# EAGLE design J2C_Video (EAGLE 7.2.0)
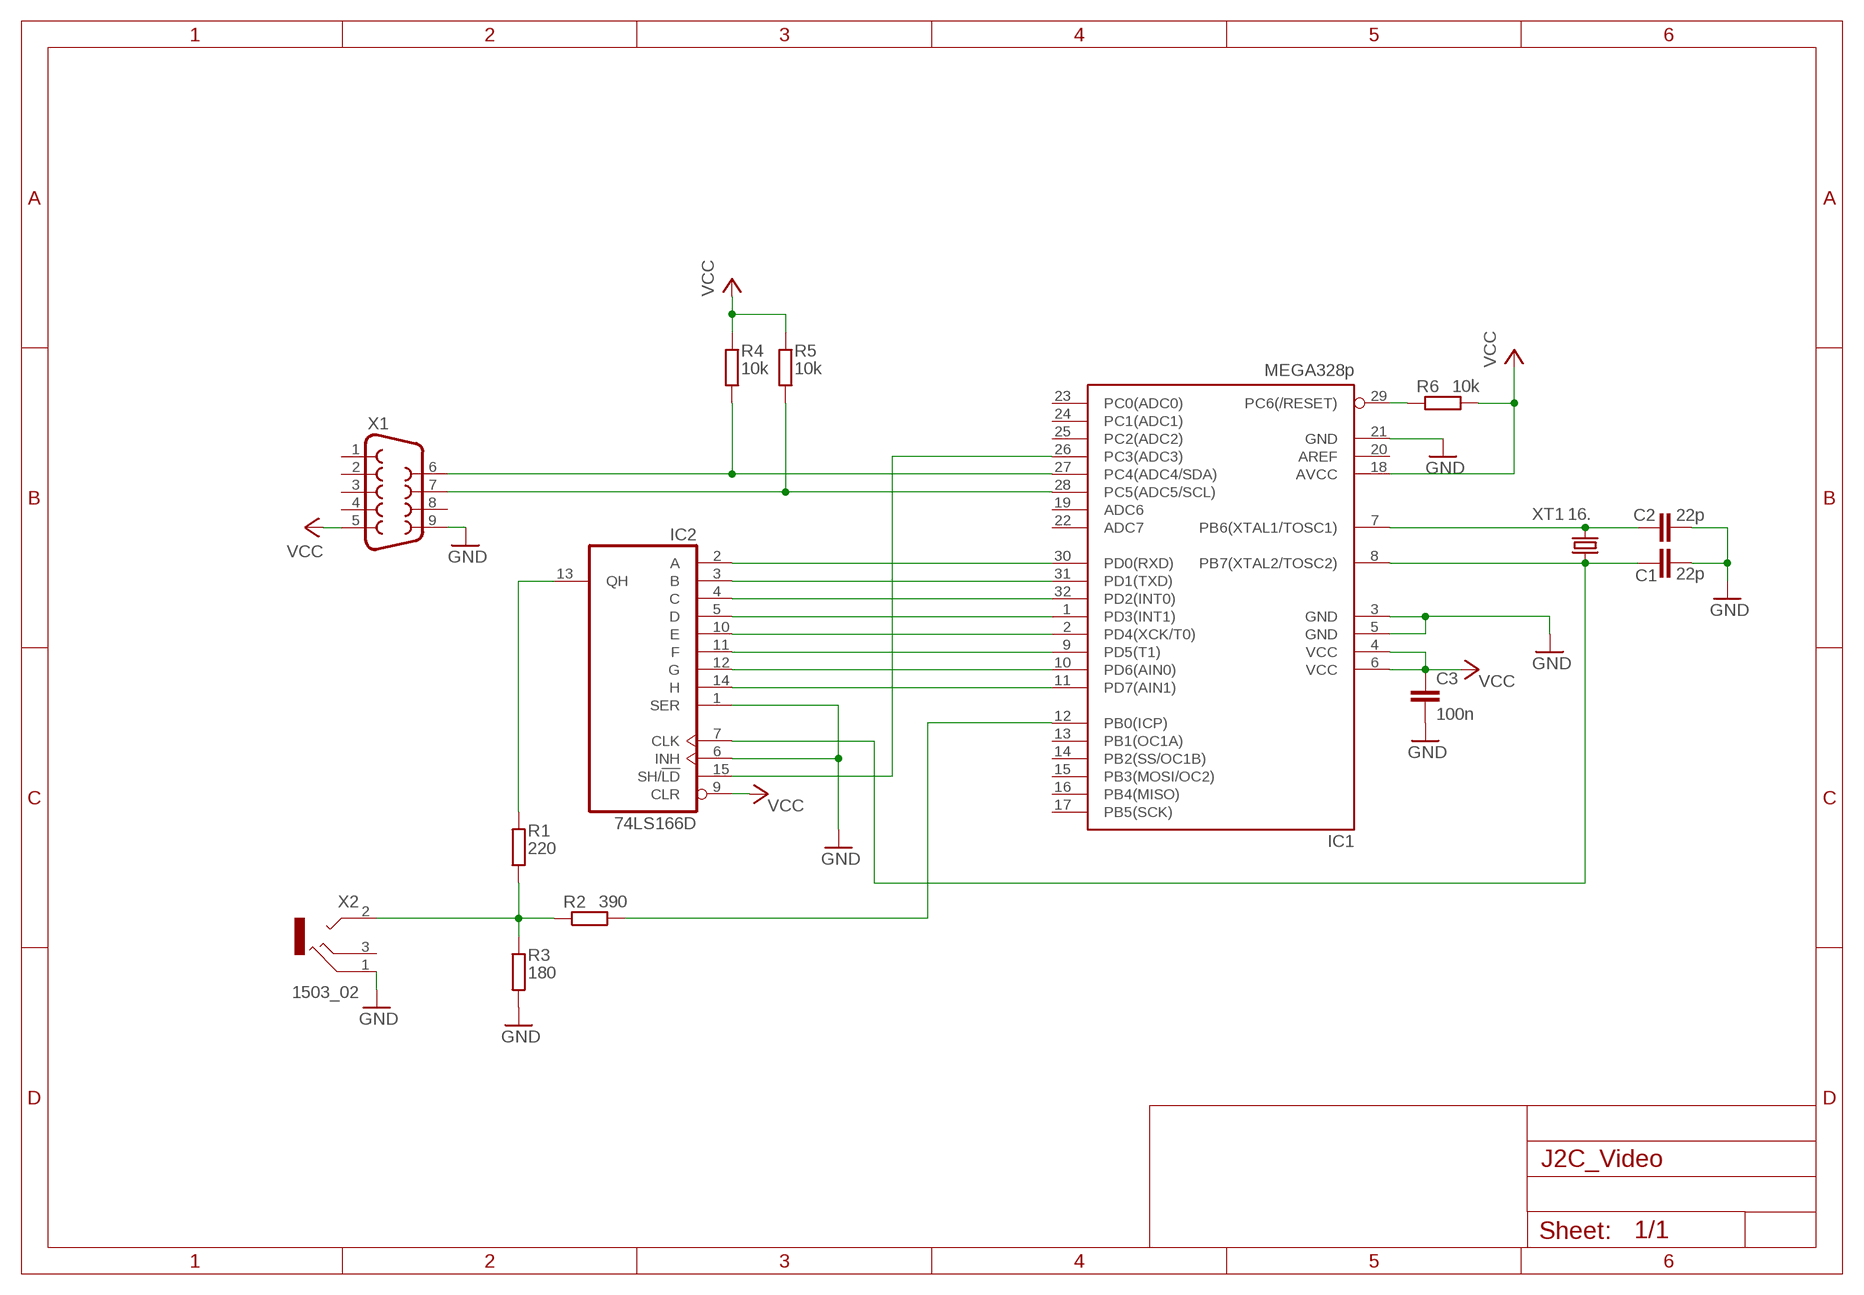
[diagram p0: schematic, sheet 1]

## Parts
C1  22p  C-EUC0805  [C0805]
C2  22p  C-EUC0805  [C0805]
C3  100n  C-EUC0805  [C0805]
IC1  MEGA328p  MEGA8-AI  [TQFP32-08]
IC2  74LS166D  [SO16]
R1  220  R-EU_M0805  [M0805]
R2  390  R-EU_M0805  [M0805]
R3  180  R-EU_M0805  [M0805]
R4  10k  R-EU_M0805  [M0805]
R5  10k  R-EU_M0805  [M0805]
R6  10k  R-EU_M0805  [M0805]
X1  F09D  [F09D]
X2  1503_02  [1503_02]
XT1  16.  CRYSTALTC26V  [TC26V]

## Nets
GND: C1.2 C2.2 C3.2 IC1.3(GND) IC1.5(GND) IC1.21(GND) IC2.1(SER) IC2.6(INH) R3.2 X1.9 X2.1
N$1: IC1.30(PD0(RXD)) IC2.2(A)
N$2: IC1.31(PD1(TXD)) IC2.3(B)
N$3: IC1.32(PD2(INT0)) IC2.4(C)
N$4: IC1.1(PD3(INT1)) IC2.5(D)
N$5: IC1.27(PC4(ADC4/SDA)) R4.2 X1.6
N$6: IC1.28(PC5(ADC5/SCL)) R5.2 X1.7
N$8: IC1.2(PD4(XCK/T0)) IC2.10(E)
N$9: IC1.9(PD5(T1)) IC2.11(F)
N$10: IC1.10(PD6(AIN0)) IC2.12(G)
N$11: IC1.11(PD7(AIN1)) IC2.14(H)
N$12: IC1.26(PC3(ADC3)) IC2.15(SH/!LD)
N$13: IC2.13(QH) R1.2
N$14: IC1.12(PB0(ICP)) R2.2
N$15: R1.1 R2.1 R3.1 X2.2
N$16: IC1.29(PC6(/RESET)) R6.1
VCC: C3.1 IC1.4(VCC) IC1.6(VCC) IC1.18(AVCC) IC2.9(CLR) R4.1 R5.1 R6.2 X1.5
X1: C2.1 IC1.7(PB6(XTAL1/TOSC1)) XT1.2
X2: C1.1 IC1.8(PB7(XTAL2/TOSC2)) IC2.7(CLK) XT1.1
Unconnected: IC1.13(PB1(OC1A)) IC1.14(PB2(SS/OC1B)) IC1.15(PB3(MOSI/OC2)) IC1.16(PB4(MISO)) IC1.17(PB5(SCK)) IC1.19(ADC6) IC1.20(AREF) IC1.22(ADC7) IC1.23(PC0(ADC0)) IC1.24(PC1(ADC1)) IC1.25(PC2(ADC2)) X1.1 X1.2 X1.3 X1.4 X1.8 X2.2@2 X2.3

## Power pins joined to a net without a drawn wire
GND: IC2.8(GND)
VCC: IC2.16(VCC)

## Library data of the parts
C1-C3 = rcl:C-EU: CAPACITOR, European symbol
IC1 = atmel:MEGA8: MICROCONTROLLER 8 Kbytes FLASH, 1 kbytes SRAM, 512 bytes EEPROM, USART, 6-channel 10 bit ADC, 2-channel 8 bit ADC Pin compatible with Atmega48, ATMega88, ATMega168 Source: avr.lbr; MPN: ATMEGA8-16AU; OC_FARNELL: 9171371; OC_NEWARK: 73M8863
IC2 = 74xx-us:74*166: 8-bit parallel load SHIFT REGISTER
R1-R6 = rcl:R-EU_: RESISTOR, European symbol
X1 = con-subd:F09: SUB-D; OC_FARNELL: unknown; OC_NEWARK: unknown
X2 = con-lumberg:1503_02: Jack connectors according to JISC 6560, 3.5 mm Klinkeneinbaukupplung nach JISC 6560, 3,5 mm, 3-polig/stereo, abgewinkelte Ausführung, Surface-Mount-Technik (SMT) Source: http://www.lumberg.com/Produkte/PDFs/1503_02.pdf; OC_FARNELL: 1216979; OC_NEWARK: unknown
XT1 = crystal:CRYSTAL: CRYSTAL; OC_FARNELL: unknown; OC_NEWARK: unknown

## Board
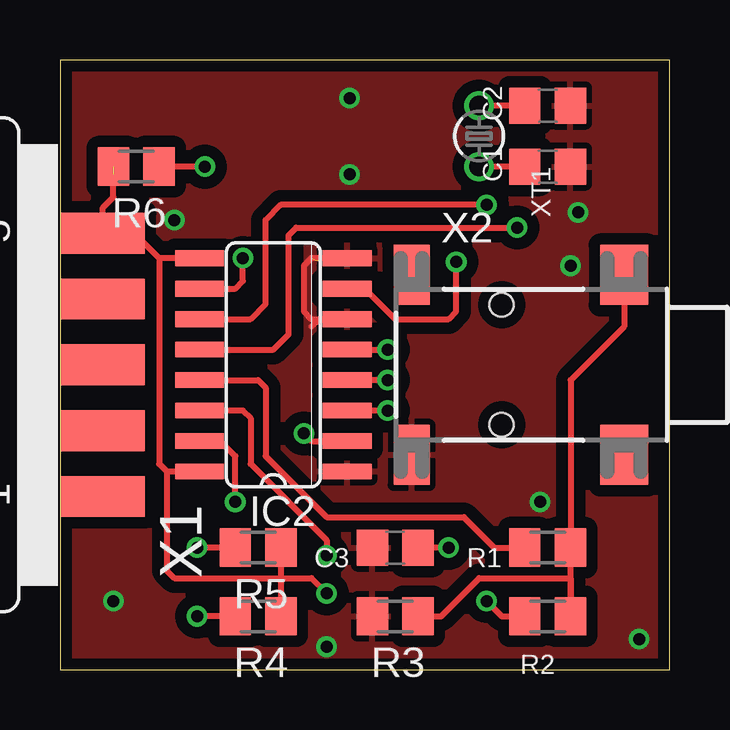
[diagram p1: board, top side]
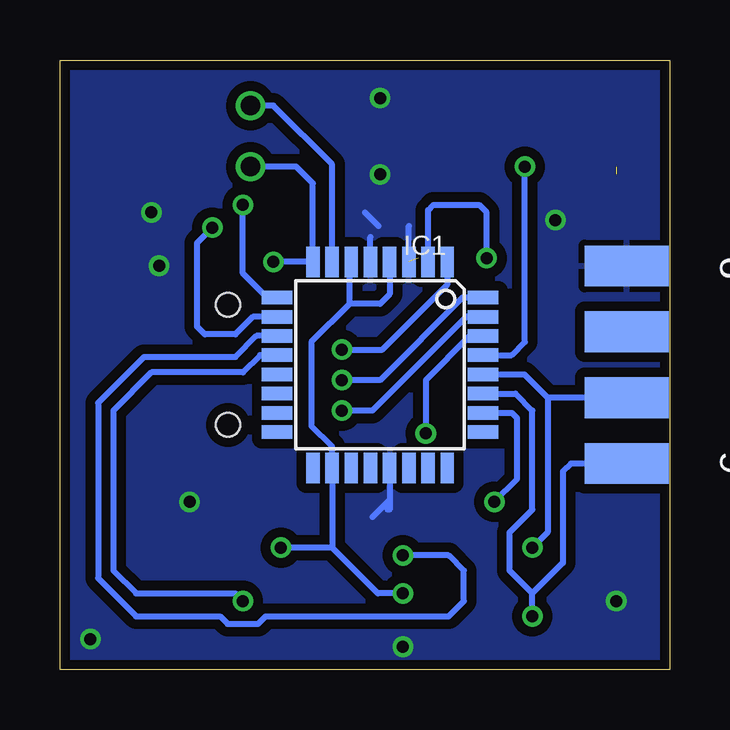
[diagram p2: board, bottom side, seen from below]

Size 25.4 x 25.4 mm. Coordinates in mm from the lower left corner, seen from the top.
Outline: 0,0 25.4,0 25.4,25.4 0,25.4 0,0
Copper layers (1*16): Top 0.0356mm / dielectric 1.5011mm / Bottom 0.0356mm
Design rules "LaenPCBOrder *": minimum track width 6mil, minimum drill 13mil, track to track 6mil, track to pad 6mil, pad to pad 6mil, via to via 6mil, smd to smd 6mil, copper to edge 15mil, drill to drill 6mil, minimum pad ring 7mil, minimum via ring 7mil, stop-mask expansion 3mil, vias tented up to drill 0mil, thermal gap 10mil

### Footprints (pad centres in the part's own frame; a part is rotated, then mirrored left to right if it is on the bottom)
C0805 = smd 1.3 x 1.5: 1 -0.95,0; 2 0.95,0
TQFP32-08 = smd 1.27 x 0.559: 1 -4.293,2.8; 2 -4.293,2; 3 -4.293,1.2; 4 -4.293,0.4; 5 -4.293,-0.4; 6 -4.293,-1.2; 7 -4.293,-2; 8 -4.293,-2.8; 17 4.293,-2.8; 18 4.293,-2; 19 4.293,-1.2; 20 4.293,-0.4; 21 4.293,0.4; 22 4.293,1.2; 23 4.293,2; 24 4.293,2.8 | smd 0.559 x 1.27: 9 -2.8,-4.293; 10 -2,-4.293; 11 -1.2,-4.293; 12 -0.4,-4.293; 13 0.4,-4.293; 14 1.2,-4.293; 15 2,-4.293; 16 2.8,-4.293; 25 2.8,4.293; 26 2,4.293; 27 1.2,4.293; 28 0.4,4.293; 29 -0.4,4.293; 30 -1.2,4.293; 31 -2,4.293; 32 -2.8,4.293
SO16 = smd 0.66 x 2.032: 1 -4.445,-3.073; 2 -3.175,-3.073; 3 -1.905,-3.073; 4 -0.635,-3.073; 5 0.635,-3.073; 6 1.905,-3.073; 7 3.175,-3.073; 8 4.445,-3.073; 9 4.445,3.073; 10 3.175,3.073; 11 1.905,3.073; 12 0.635,3.073; 13 -0.635,3.073; 14 -1.905,3.073; 15 -3.175,3.073; 16 -4.445,3.073
M0805 = smd 1.3 x 1.6: 1 -0.95,0; 2 0.95,0
F09D = smd 1.7 x 3.5: 1 -5.486,-6.045; 2 -2.743,-6.045; 3 0,-6.045; 4 2.743,-6.045; 5 5.486,-6.045 | smd 1.7 x 3.5 bottom: 6 -4.115,-6.045; 7 -1.372,-6.045; 8 1.372,-6.045; 9 4.115,-6.045
1503_02 = smd 2.5 x 1.5: 1 3.75,-10.75; 3 -3.75,-10.75 | smd 2.5 x 2: 2 -3.75,-1.9; 2@2 3.75,-1.9 | hole 1: -2.5,-7; 2.5,-7
TC26V = drill 0.813: 1 -1.27,0; 2 1.27,0

### Placement (x,y rotation side)
C1  20.32,20.95 0 top
C2  20.32,23.5 0 top
C3  13.97,5.08 180 top
IC1  12.06,12.7 270 bottom
IC2  8.89,12.7 90 top
R1  20.32,5.08 180 top
R2  20.32,2.22 180 top
R3  13.97,2.22 180 top
R4  8.26,2.22 180 top
R5  8.26,5.08 180 top
R6  3.17,20.95 180 top
X1  -4.25,12.7 90 top
X2  25.4,12.7 270 top
XT1  17.46,22.23 90 top

### Tracks (layer width: path | path; a pad name or v marks a point on that pad's centre or on a via)
GND  (via drill 0.5)  (1 unrouted)
  Top 0.254: IC2.8 10.48,17.14 10.16,16.83 10.16,14.92 10.48,14.61 IC2.6 10.79,14.61 10.48,14.29
  Bottom 0.254: 12.13,18.48 12.7,19.05 | IC1.5 12.46,18.02 | IC1.3 10.87,18.48 | IC1.21 11.66,7.07 12.38,6.35 | IC1.21 11.66,8.02 | IC1.21 11.66,6.67 11.75,6.67
  other vias: 12.06,20.64 21.27,16.83 11.11,0.95 2.22,2.86 21.59,19.05 4.76,18.73 24.13,1.27 12.06,23.81 20,6.99
  pour Top (isolate 0.483): 0,25.4 0,0 25.4,0 25.4,25.4
  pour Bottom (isolate 0.406): 25.4,0 25.4,25.4 0,25.4 0,0
N$1  (via drill 0.5)
  Top 0.254: v10.16,9.84 10.48,9.53 IC2.2
  Bottom 0.254: IC1.30 8.32,13.9 10.16,12.06 v10.16,9.84
N$2  (via drill 0.5)
  Top 0.254: v13.65,10.79 IC2.3
  Bottom 0.254: IC1.31 8.48,14.7 12.38,10.79 v13.65,10.79
N$3  (via drill 0.5)
  Top 0.254: v13.65,12.06 IC2.4
  Bottom 0.254: IC1.32 8.63,15.5 12.06,12.06 v13.65,12.06
N$4  (via drill 0.5)
  Top 0.254: IC2.5 v13.65,13.34
  Bottom 0.254: v13.65,13.34 IC2.5 9.27,16.03 IC1.1
N$5  (via drill 0.5)
  Top 0.254: R4.2 v5.71,2.22
  Bottom 0.254: X1.6 4.12,8.59 4.45,8.26 4.45,4.45 5.71,3.17 | 5.71,3.17 6.67,4.13 6.67,5.71 5.71,6.67 5.71,10.79 6.42,11.5 IC1.27 | v5.71,2.22 5.71,3.17
N$6  (via drill 0.5)
  Top 0.254: R5.2 v5.71,5.08
  Bottom 0.254: X1.7 5.08,11.33 | 5.08,11.33 5.08,5.71 v5.71,5.08 | IC1.28 6.05,12.3 5.08,11.33
N$8  (via drill 0.5)
  Top 0.254: IC2.10 7.3,15.88 7.62,16.19 v7.62,17.14
  Bottom 0.254: v7.62,17.14 7.62,19.05 7.94,19.37 9.84,19.37 10.06,19.14 IC1.2
N$9  (via drill 0.5)
  Top 0.254: IC2.11 7.94,14.61 8.57,15.24 8.57,18.73 9.21,19.37 v17.78,19.37
  Bottom 0.254: IC1.9 16.77,15.5 17.78,16.51 v17.78,19.37
N$10  (via drill 0.5)
  Top 0.254: IC2.12 8.89,13.34 9.53,13.97 9.53,18.1 9.84,18.41 v19.05,18.41
  Bottom 0.254: IC1.10 17.37,14.7 18.1,13.97 19.37,13.97 19.68,14.29 19.68,17.78 v19.05,18.41
N$11  (via drill 0.5)
  Top 0.254: IC2.14 7.62,10.79 7.94,10.48 7.94,8.57 11.11,5.4 v11.11,4.76
  Bottom 0.254: v11.11,4.76 9.21,4.76 8.57,4.13 8.57,2.86 9.21,2.22 16.83,2.22 17.14,1.91 18.41,1.91 18.73,2.22 22.23,2.22 23.81,3.81 23.81,11.11 21.91,13.02 18.1,13.02 17.21,13.9 IC1.11
N$12  (via drill 0.5)
  Top 0.254: v7.3,6.99 7.3,8.89 6.67,9.53 IC2.15
  Bottom 0.254: v7.3,6.99 6.35,7.94 6.35,10.48 6.57,10.7 IC1.26
N$13
  Top 0.254: IC2.13 8.26,12.06 8.57,11.75 8.57,8.89 11.11,6.35 16.83,6.35 18.1,5.08 R1.2
N$14  (via drill 0.5)
  Top 0.254: v17.78,2.86 18.41,2.22 R2.2
  Bottom 0.254: IC1.12 17.06,13.1 17.78,12.38 21.59,12.38 23.18,10.79 23.18,4.13 22.23,3.17 18.1,3.17 v17.78,2.86
N$15
  Top 0.254: X2.2 23.5,14.29 21.27,12.06 R1.1 R2.1 21.27,3.81 17.46,3.81 15.88,2.22 R3.1
N$16  (via drill 0.5)
  Top 0.254: v6.03,20.95 R6.1
  Bottom 0.254: IC1.29 6.58,13.1 6.03,13.65 v6.03,20.95
VCC  (via drill 0.5)  (1 unrouted)
  Top 0.254: 4.13,17.14 4.13,8.57 4.45,8.26 | 4.45,8.26 IC2.16 | v16.19,5.08 C3.1 | 4.45,8.26 4.45,4.13 4.76,3.81 9.21,3.81 | 2.22,20.64 | IC2.9 4.13,17.14 | 4.13,17.14 3.09,18.19 X1.5 1.79,19.25 2.22,19.68 R6.2 | R5.1 9.21,3.81 | 9.21,3.81 R4.1 | 9.21,3.81 10.48,3.81 v11.11,3.17
  Bottom 0.254: IC1.4 11.66,15.64 12.06,15.24 13.34,15.24 | 13.34,15.24 14.92,13.65 14.92,10.16 14.06,9.3 IC1.18 14.06,5.08 | 13.34,15.24 13.34,16.92 IC1.6 | 14.06,5.08 v16.19,5.08 | v11.11,3.17 12.16,3.17 14.06,5.08
X1
  Top 0.254: C2.1 XT1.2
  Bottom 0.254: IC1.7 14.06,21.05 16.51,23.5 XT1.2
X2  (via drill 0.5)
  Top 0.254: C1.1 XT1.1 | IC2.7 12.7,15.88 13.97,14.61 16.19,14.61 16.51,14.92 v16.51,16.99
  Bottom 0.254: XT1.1 15.56,20.95 14.87,20.26 IC1.8 v16.51,16.99